# Altium schematic sheet DC  3_Converter.SchDoc
size A3; Date: 2025/09/22; ApprovedBy: NA; Author: 邱上峯; CompanyName: JFM常裕富士機工; Engineer: 邱上峯; Revision: V1.0; SheetNumber: 6; SheetTotal: 7; Pcb Name: NA
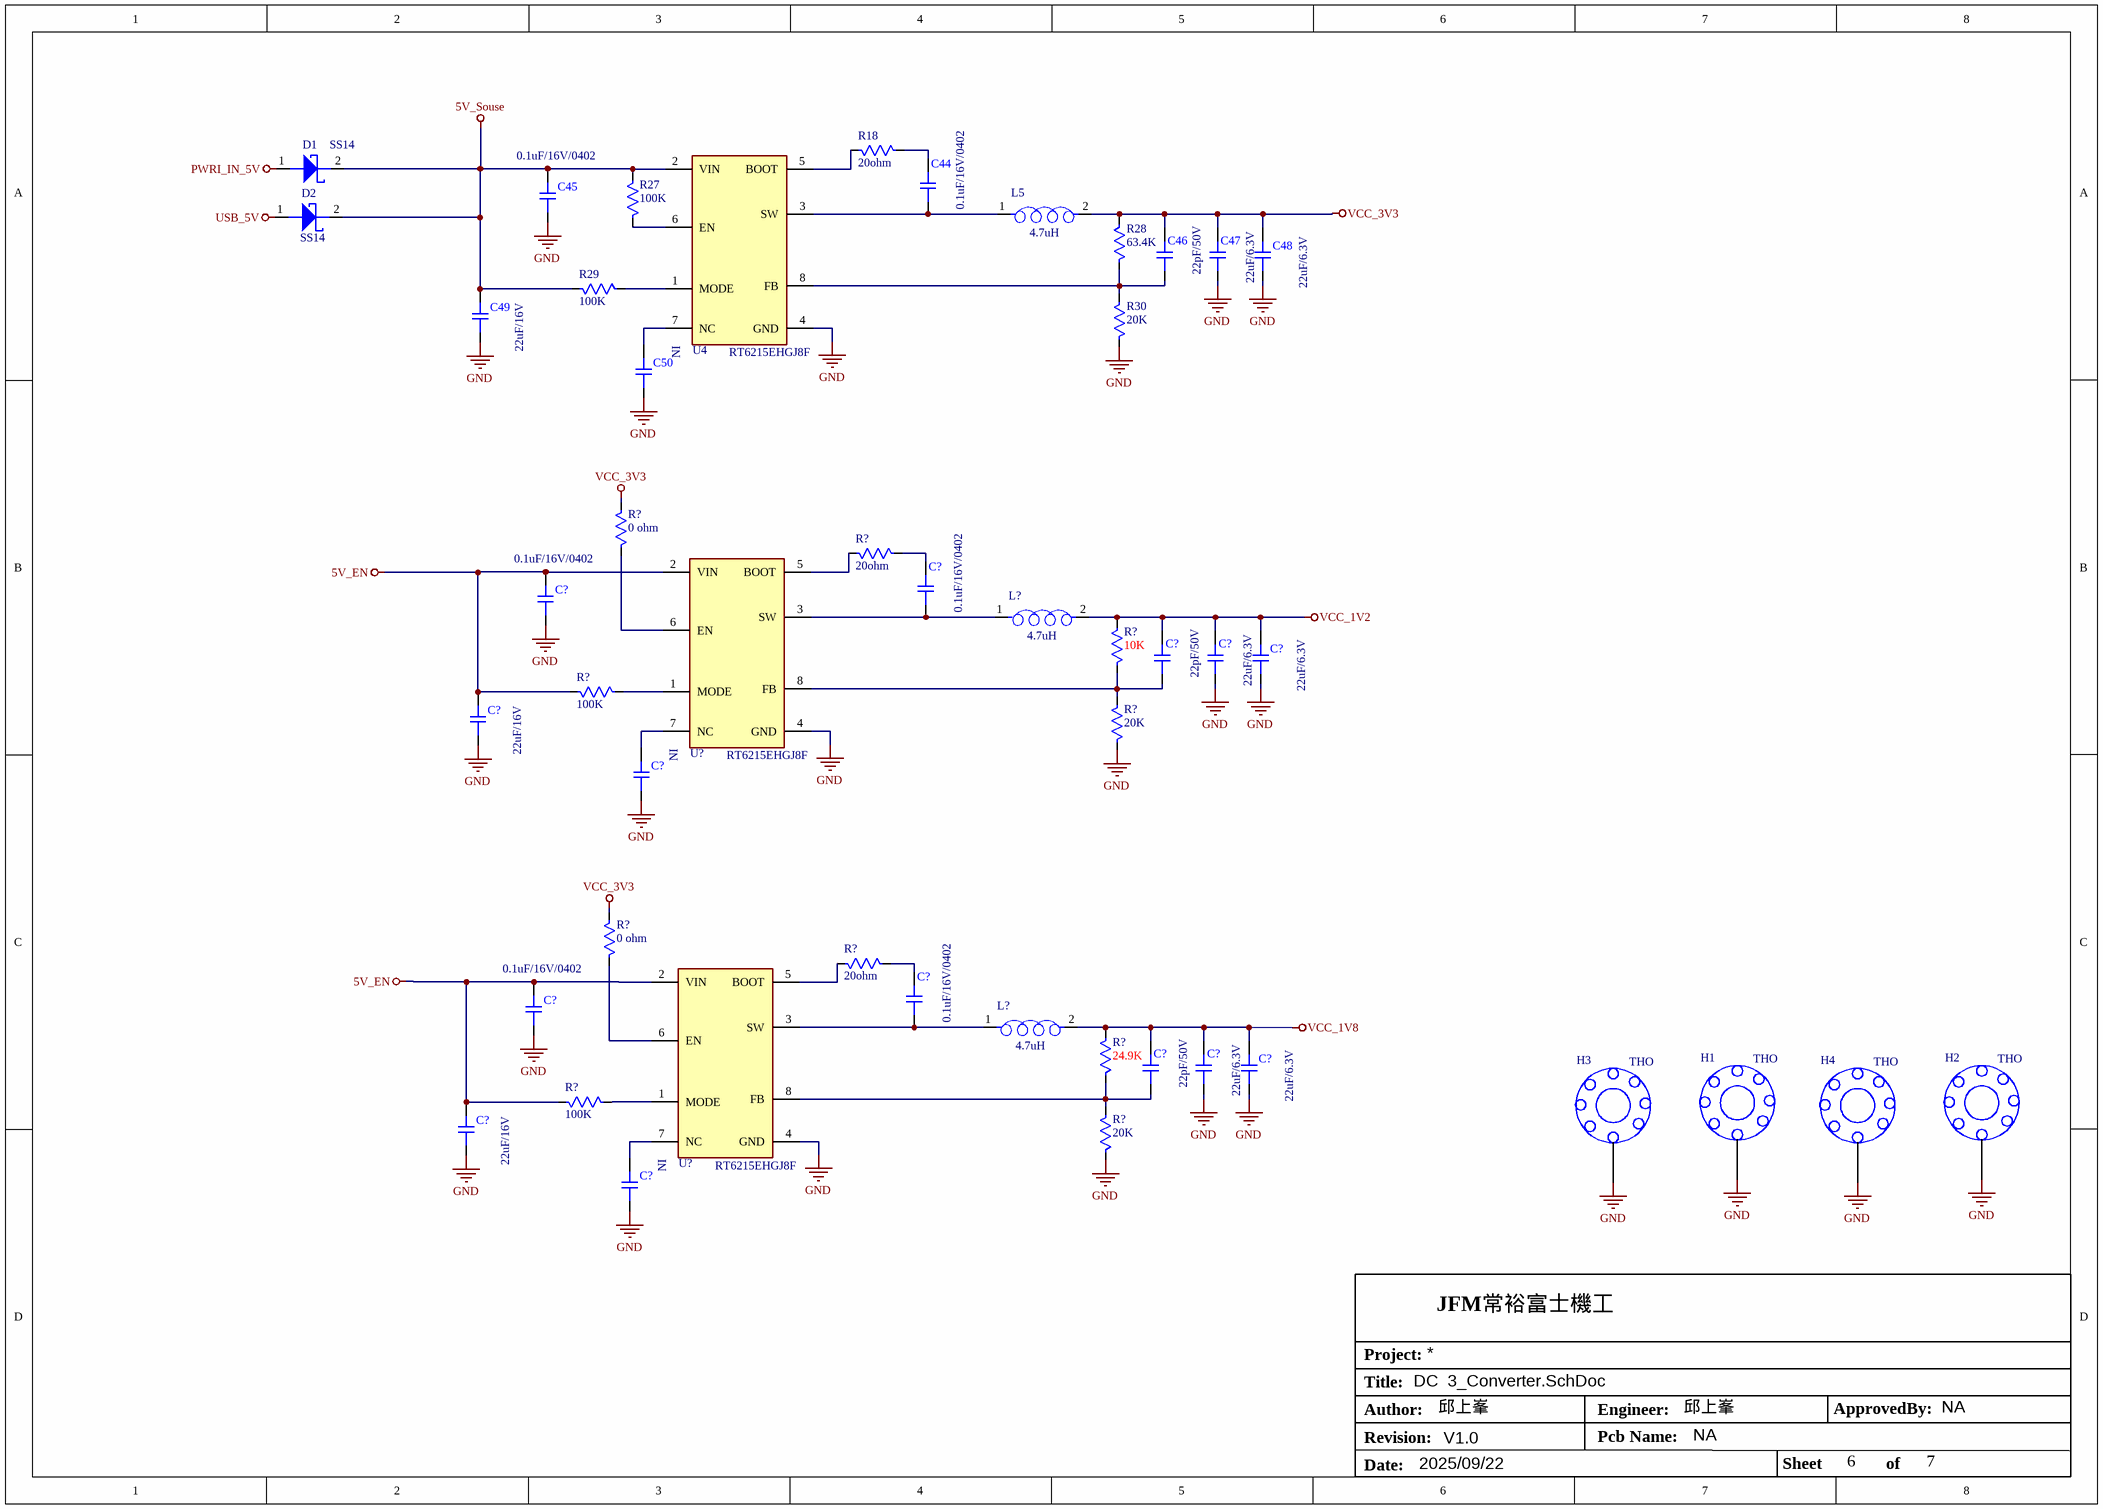
[diagram p0: DC  3_Converter.SchDoc]

## Parts
(Parts that share a designator on the sheet are numbered #1, #2 ... from top to bottom, then left to right.)
C44  0.1uF/16V/0402  [C0402]
C45  0.1uF/16V/0402  [C0402]
C46  22pF/50V  [C0402]
C47  22uF/6.3V  [C0402]
C48  22uF/6.3V  [C0402]
C49  22uF/16V  [C0402]
C50  NI  [C0402]
C?#1  0.1uF/16V/0402  [C0402]
C?#2  0.1uF/16V/0402  [C0402]
C?#3  22pF/50V  [C0402]
C?#4  22uF/6.3V  [C0402]
C?#5  22uF/6.3V  [C0402]
C?#6  22uF/16V  [C0402]
C?#7  NI  [C0402]
C?#8  0.1uF/16V/0402  [C0402]
C?#9  0.1uF/16V/0402  [C0402]
C?#10  22pF/50V  [C0402]
C?#11  22uF/6.3V  [C0402]
C?#12  22uF/6.3V  [C0402]
C?#13  22uF/16V  [C0402]
C?#14  NI  [C0402]
D1  SS14  [DO-214AC (SMA)]
D2  SS14  [DO-214AC (SMA)]
H1  THO  [TPH-3.4mm]
H2  THO  [TPH-3.4mm]
H3  THO  [TPH-3.4mm]
H4  THO  [TPH-3.4mm]
L5  4.7uH  [IND-HPI0402]
L?#1  4.7uH  [IND-HPI0402]
L?#2  4.7uH  [IND-HPI0402]
R18  20ohm  [R0603]
R27  100K  [R0603]
R28  63.4K  [R0603]
R29  100K  [R0603]
R30  20K  [R0603]
R?#1  20ohm  [R0603]
R?#2  0 ohm  [R0402]
R?#3  10K  [R0603]
R?#4  100K  [R0603]
R?#5  20K  [R0603]
R?#6  0 ohm  [R0402]
R?#7  20ohm  [R0603]
R?#8  24.9K  [R0603]
R?#9  100K  [R0603]
R?#10  20K  [R0603]
U4  RT6215EHGJ8F  [SOT65P280X100-8N]
U?#1  RT6215EHGJ8F  [SOT65P280X100-8N]
U?#2  RT6215EHGJ8F  [SOT65P280X100-8N]

## Nets
5V_EN: C?#2.2 C?#6.2 C?#9.2 C?#13.2 R?#4.2 R?#9.2 U?#1.2(VIN) U?#2.2(VIN)
5V_Souse: C45.2 C49.2 D1.2(CATHODE) D2.2(CATHODE) R27.2 R29.2 U4.2(VIN)
GND: C45.1 C47.1 C48.1 C49.1 C50.1 C?#2.1 C?#4.1 C?#5.1 C?#6.1 C?#7.1 C?#9.1 C?#11.1 C?#12.1 C?#13.1 C?#14.1 H1.0 H2.0 H3.0 H4.0 R30.2 R?#5.2 R?#10.2 U4.4(GND) U?#1.4(GND) U?#2.4(GND)
PWRI_IN_5V: D1.1(ANODE)
USB_5V: D2.1(ANODE)
VCC_1V2: C?#3.2 C?#4.2 C?#5.2 L?#1.2 R?#3.1
VCC_1V8: C?#10.2 C?#11.2 C?#12.2 L?#2.2 R?#8.1
VCC_3V3: C46.2 C47.2 C48.2 L5.2 R28.1 R?#2.2 R?#6.2
NetC44_1: C44.1 L5.1 U4.3(SW)
NetC44_2: C44.2 R18.1
NetC46_1: C46.1 R28.2 R30.1 U4.8(FB)
NetC50_2: C50.2 U4.7(NC)
NetC?#1_1: C?#1.1 L?#1.1 U?#1.3(SW)
NetC?#1_2: C?#1.2 R?#1.1
NetC?#3_1: C?#3.1 R?#3.2 R?#5.1 U?#1.8(FB)
NetC?#7_2: C?#7.2 U?#1.7(NC)
NetC?#8_1: C?#8.1 L?#2.1 U?#2.3(SW)
NetC?#8_2: C?#8.2 R?#7.1
NetC?#10_1: C?#10.1 R?#8.2 R?#10.1 U?#2.8(FB)
NetC?#14_2: C?#14.2 U?#2.7(NC)
NetR18_2: R18.2 U4.5(BOOT)
NetR27_1: R27.1 U4.6(EN)
NetR29_1: R29.1 U4.1(MODE)
NetR?#1_2: R?#1.2 U?#1.5(BOOT)
NetR?#2_1: R?#2.1 U?#1.6(EN)
NetR?#4_1: R?#4.1 U?#1.1(MODE)
NetR?#6_1: R?#6.1 U?#2.6(EN)
NetR?#7_2: R?#7.2 U?#2.5(BOOT)
NetR?#9_1: R?#9.1 U?#2.1(MODE)

## Notes on the sheet
- Title:
- Project:
- Date:
- Author:
- Revision:
- Engineer:
- Pcb Name:
- Sheet
- ApprovedBy:
- of

## Library data of the parts
C44-C49 C?#1-C?#6 C?#8-C?#13 = Cap
C50 C?#7 C?#14 = Cap: 3.9nF/16V
D1 D2 = DIODE SCHOTTKY: Schottky Diodes & Rectifiers 1A, 40V, Schottky Rectifier
L5 L?#1 L?#2 = INDUCTOR: 3L COILS/HPI0402-4R7M
R18 R27-R30 R?#1-R?#10 = Res
U4 U?#1 U?#2 = RT6215EHGJ8F: DC/DC CONV, SYNC BUCK, 500KHZ, TSOT-23-8; Topology:Synchronous Buck (Step Down); Input Voltage Min:4.5V; Input Voltage Max:24V; No. of Outputs:1Outputs; DC / DC Converter IC Case:TSOT-23; No. of Pins:8Pins; Output Current:2A; Output RoHS Compliant: Yes; Manufacturer_Name: RICHTEK; Geometry.Height: 1mm; Mouser Part Number: *; Mouser Price/Stock: *; Manufacturer_Part_Number: RT6215EHGJ8F; Datasheet Link: https://componentsearchengine.com/Datasheets/2/RT6215EHGJ8F.pdf